# EAGLE design shield (EAGLE 9.6.2)
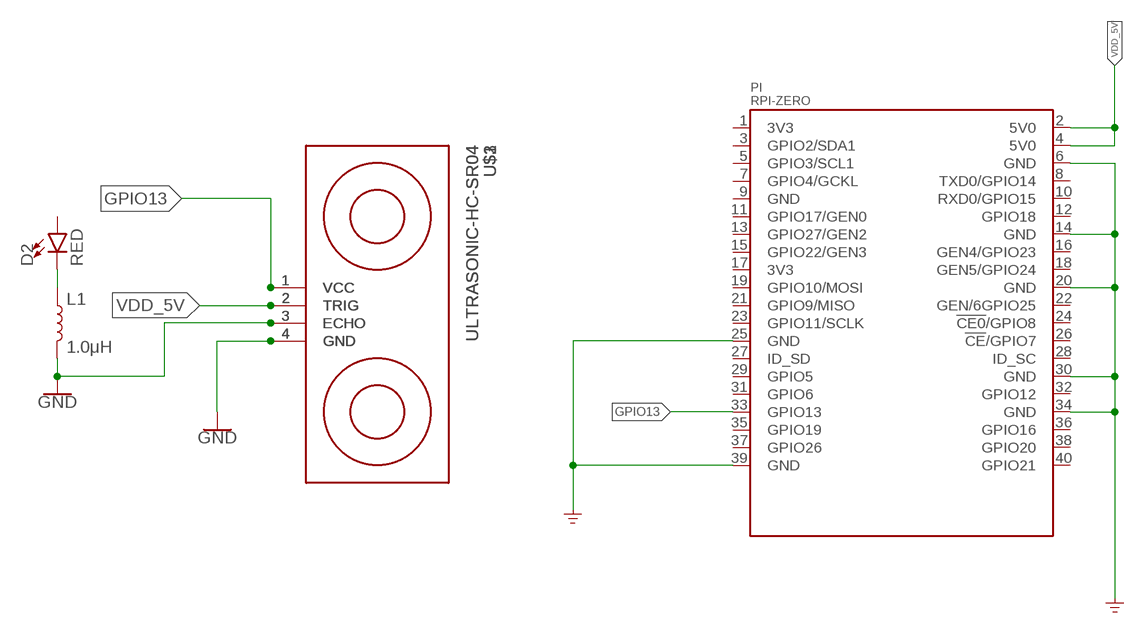
[diagram p0: schematic, sheet 1]

## Parts
D2  RED  LED-RED0603  [LED-0603]
L1  1.0μH  1.0μH-0805_WIDE-1.0μH-1.4A-0.07OHM-1.4MM_H  [0805-WIDE]
PI  RPI-ZERO  [RASPBERRYPI_BASTELSTUBE_V13_RASPI_BOARD_B+_FULL]
U$1  ULTRASONIC-HC-SR04  [ULTRASONIC-HC-SR04]
U$2  ULTRASONIC-HC-SR04  [ULTRASONIC-HC-SR04]
U$3  ULTRASONIC-HC-SR04  [ULTRASONIC-HC-SR04]

## Nets
GND: L1.2 PI.6(GND) PI.14(GND) PI.20(GND) PI.25(GND) PI.30(GND) PI.34(GND) PI.39(GND) U$1.3(ECHO) U$2.3(ECHO) U$3.3(ECHO) ; supply symbol labelled GND_POWER
GPIO13: PI.33(GPIO13) U$1.1(VCC) U$2.1(VCC) U$3.1(VCC)
N$1: D2.C L1.1
N$2: U$1.4(GND) U$2.4(GND) U$3.4(GND) ; supply symbol labelled GND
VDD_5V: PI.2(5V0) PI.4(5V0) U$1.2(TRIG) U$2.2(TRIG) U$3.2(TRIG)
Unconnected: D2.A PI.1(3V3) PI.3(GPIO2/SDA1) PI.5(GPIO3/SCL1) PI.7(GPIO4/GCKL) PI.8(TXD0/GPIO14) PI.9(GND) PI.10(RXD0/GPIO15) PI.11(GPIO17/GEN0) PI.12(GPIO18) PI.13(GPIO27/GEN2) PI.15(GPIO22/GEN3) PI.16(GEN4/GPIO23) PI.17(3V3) PI.18(GEN5/GPIO24) PI.19(GPIO10/MOSI) PI.21(GPIO9/MISO) PI.22(GEN/6GPIO25) PI.23(GPIO11/SCLK) PI.24(!CE0!/GPIO8) PI.26(!CE!/GPIO7) PI.27(ID_SD) PI.28(ID_SC) PI.29(GPIO5) PI.31(GPIO6) PI.32(GPIO12) PI.35(GPIO19) PI.36(GPIO16) PI.37(GPIO26) PI.38(GPIO20) PI.40(GPIO21)

## Library data of the parts
D2 = SparkFun-LED:LED-RED: Red SMD LED Used in manufacturing of most products at SparkFun Packages: 0603 - SMD 0603 package [Product Link] <http://docs.avagotech.com/docs/AV02-0551EN> 0603 SMART - SMD 0603 SMART package ( more efficient and expensive)[Product Link] <http://www.osram-os.com/Graphics/XPic2/00077099_0.pdf> 1206 - SMD1206 package [Product Link] <https://www.sparkfun.com/datasheets/DevTools/LilyPad/Q150OVS4.pdff> SparkFun Products: Pro Mini 328 -5V <https://www.sparkfun.com/products/821> RedBoard <https://www.sparkfun.com/products/12757> IOIO-OTG <https://www.sparkfun.com/products/13613>; PROD_ID: DIO-00819
L1 = SparkFun-Coils:1.0μH: 1.0μH Inductor Resist changes in electrical current. Basically a coil of wire. SparkFun Products: SparkFun Edge <https://www.sparkfun.com/products/15170>; PROD_ID: NDUC-14237
PI = RPI-Zero:RPI-ZERO
U$1-U$3 = diy-modules:ULTRASONIC-HC-SR04: Ultrasonic Ranging Module HC-SR04 More details available here: http://randomnerdtutorials.com/complete-guide-for-ultrasonic-sensor-hc-sr04/ Click here to find device on ebay.com <http://www.ebay.com/sch/hc+sr04+ultrasonic>

## Board
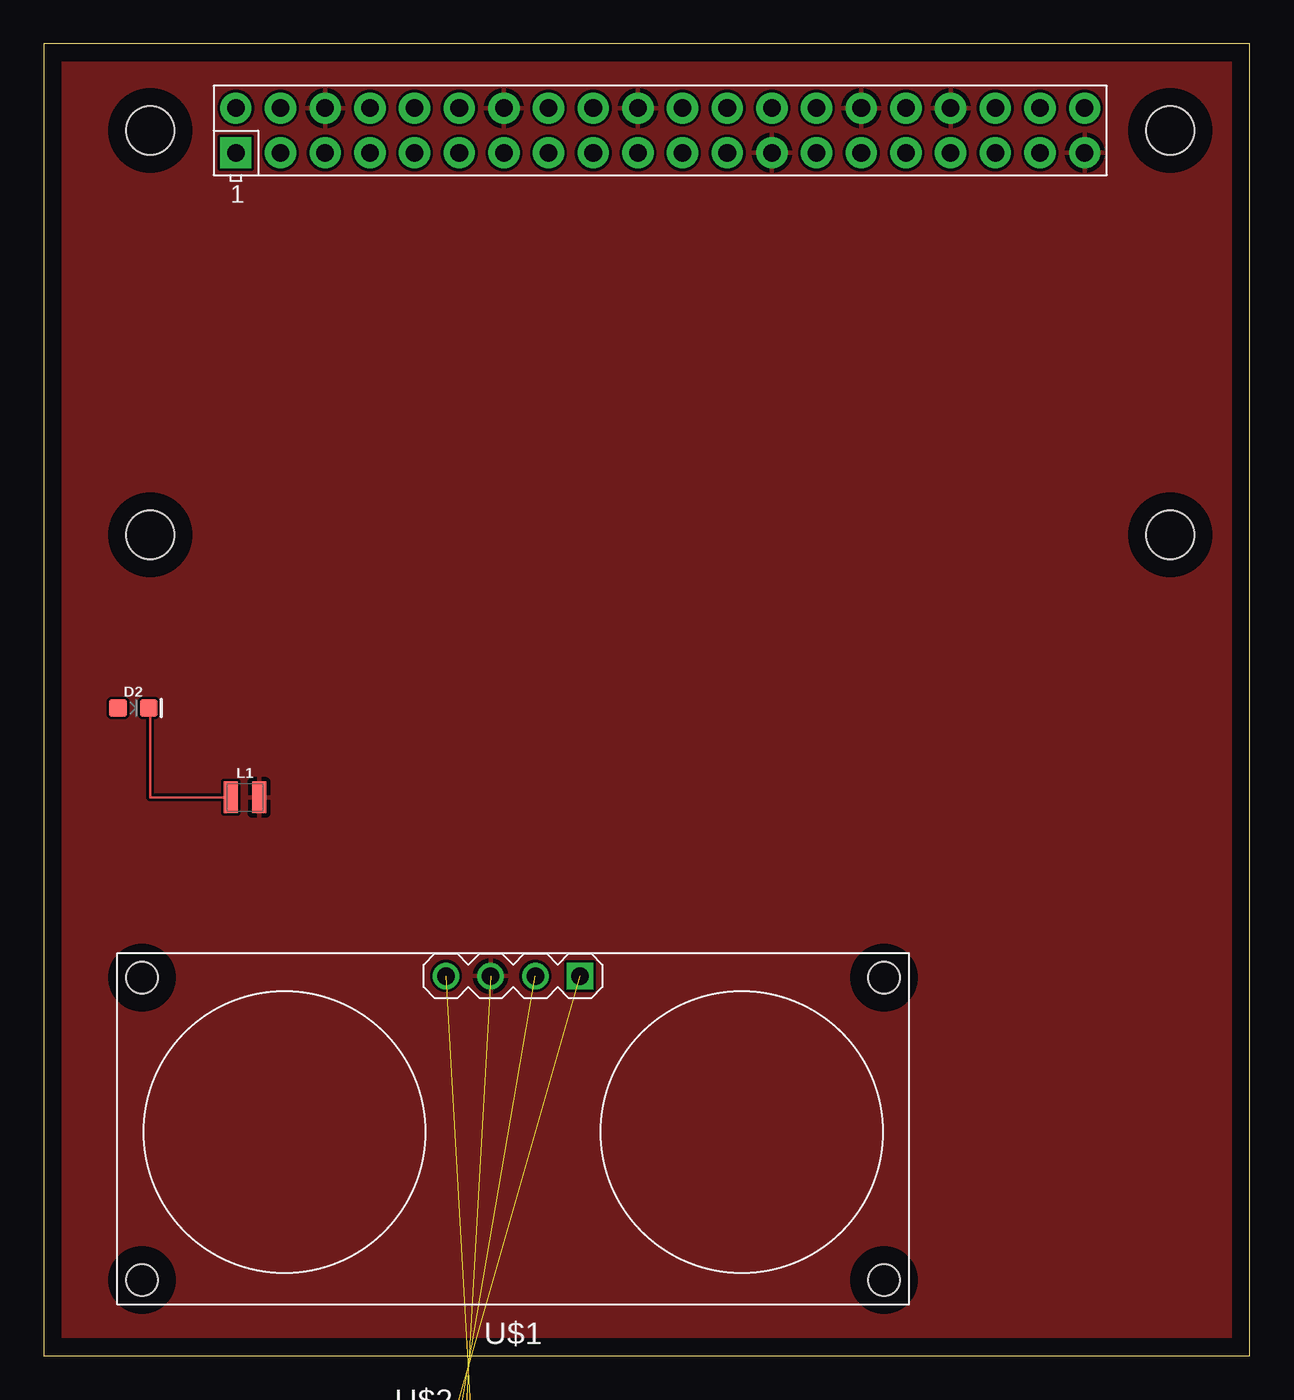
[diagram p1: board, top side]
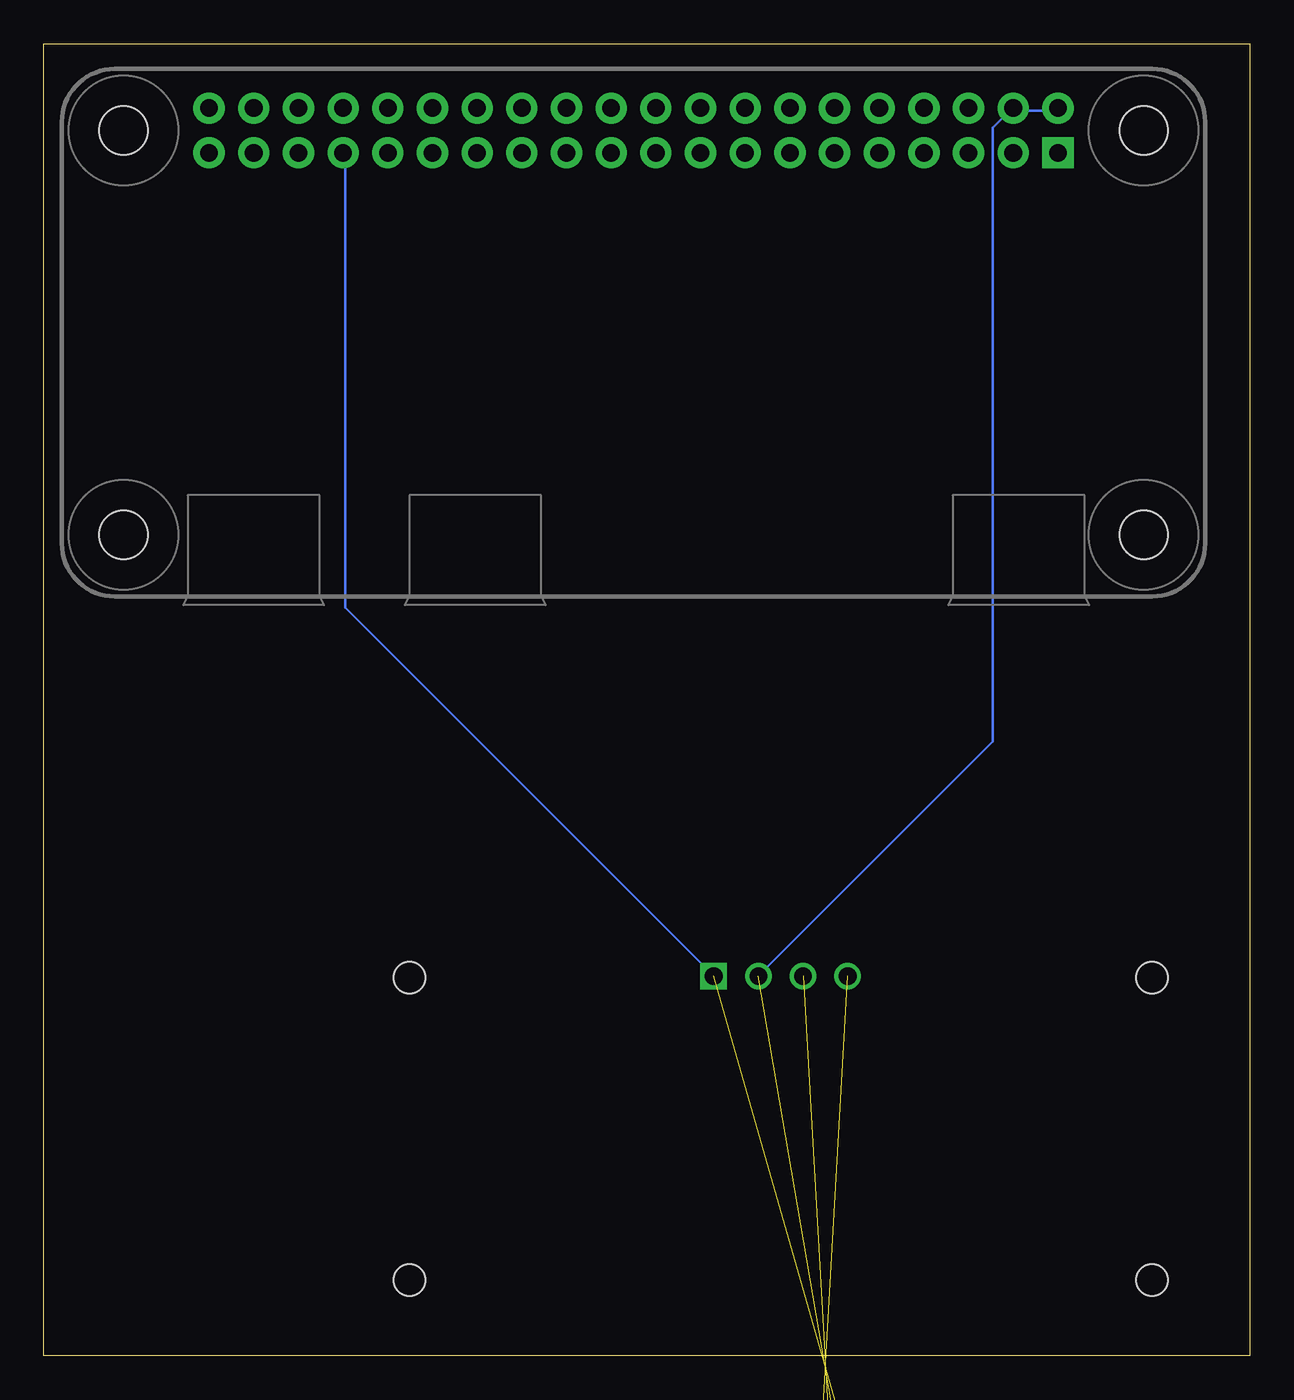
[diagram p2: board, bottom side, seen from below]

Size 68.56 x 74.6 mm. Coordinates in mm from the lower left corner, seen from the top.
Outline: 0,0 68.56,0 68.56,74.6 0,74.6 0,0
Copper layers (1*16): Top 0.035mm / dielectric 1.5mm / Bottom 0.035mm
Design rules "default": minimum track width 6mil, minimum drill 0.35mm, track to track 6mil, track to pad 6mil, pad to pad 6mil, via to via 6mil, smd to smd 6mil, copper to edge 40mil, drill to drill 6mil, minimum pad ring 10mil, minimum via ring 8mil, stop-mask expansion 4mil, vias tented up to drill 0mil, thermal gap 10mil

### Footprints (pad centres in the part's own frame; a part is rotated, then mirrored left to right if it is on the bottom)
LED-0603 = smd 1 x 1: A -0.877,0; C 0.877,0
0805-WIDE = smd 0.8 x 1.8: 1 -0.8,0; 2 0.8,0
RASPBERRYPI_BASTELSTUBE_V13_RASPI_BOARD_B+_FULL = drill 1 pad 1.778 square: 1 8.37,25.23 | drill 1 pad 1.778: 2 8.37,27.77; 3 10.91,25.23; 4 10.91,27.77; 5 13.45,25.23; 6 13.45,27.77; 7 15.99,25.23; 8 15.99,27.77; 9 18.53,25.23; 10 18.53,27.77; 11 21.07,25.23; 12 21.07,27.77; 13 23.61,25.23; 14 23.61,27.77; 15 26.15,25.23; 16 26.15,27.77; 17 28.69,25.23; 18 28.69,27.77; 19 31.23,25.23; 20 31.23,27.77; 21 33.77,25.23; 22 33.77,27.77; 23 36.31,25.23; 24 36.31,27.77; 25 38.85,25.23; 26 38.85,27.77; 27 41.39,25.23; 28 41.39,27.77; 29 43.93,25.23; 30 43.93,27.77; 31 46.47,25.23; 32 46.47,27.77; 33 49.01,25.23; 34 49.01,27.77; 35 51.55,25.23; 36 51.55,27.77; 37 54.09,25.23; 38 54.09,27.77; 39 56.63,25.23; 40 56.63,27.77 | hole 2.75: 3.5,3.5; 3.5,26.5; 61.5,3.5; 61.5,26.5
ULTRASONIC-HC-SR04 = drill 1 square: 1 -3.81,-8.89 | drill 1: 2 -1.27,-8.89; 3 1.27,-8.89; 4 3.81,-8.89 | hole 1.8: -21.1,8.4; -21.1,-8.8; 21.1,-8.8; 21.1,8.4

### Placement (x,y rotation side)
D2  5.08,36.83 0 top
L1  11.43,31.75 0 top
PI  2.54,43.18 0 top
U$1  26.67,12.7 180 top
U$2  21.59,-13.97 0 top  (outside the outline)
U$3  21.59,-40.64 0 top  (outside the outline)

### Tracks (layer width: path | path; a pad name or v marks a point on that pad's centre or on a via)
GND  (2 unrouted)
  pour Top: -1.27,76.2 -1.27,-1.27 69.85,-1.27 69.85,76.2
GPIO13  (2 unrouted)
  Bottom 0.152: U$1.1 51.44,42.55 51.44,68.26 PI.33
N$1
  Top 0.152: L1.1 6.03,31.75 6.03,36.83 D2.C
N$2  (2 unrouted)
VDD_5V  (2 unrouted)
  Bottom 0.152: U$1.2 14.61,34.92 14.61,69.85 13.65,70.8 PI.4 13.34,70.8 11.11,70.8 PI.2